# Altium schematic sheet [07] - CONNECTORS 2.SchDoc
size A3; DocumentNumber: 7; SheetNumber: 7; SheetTotal: 9
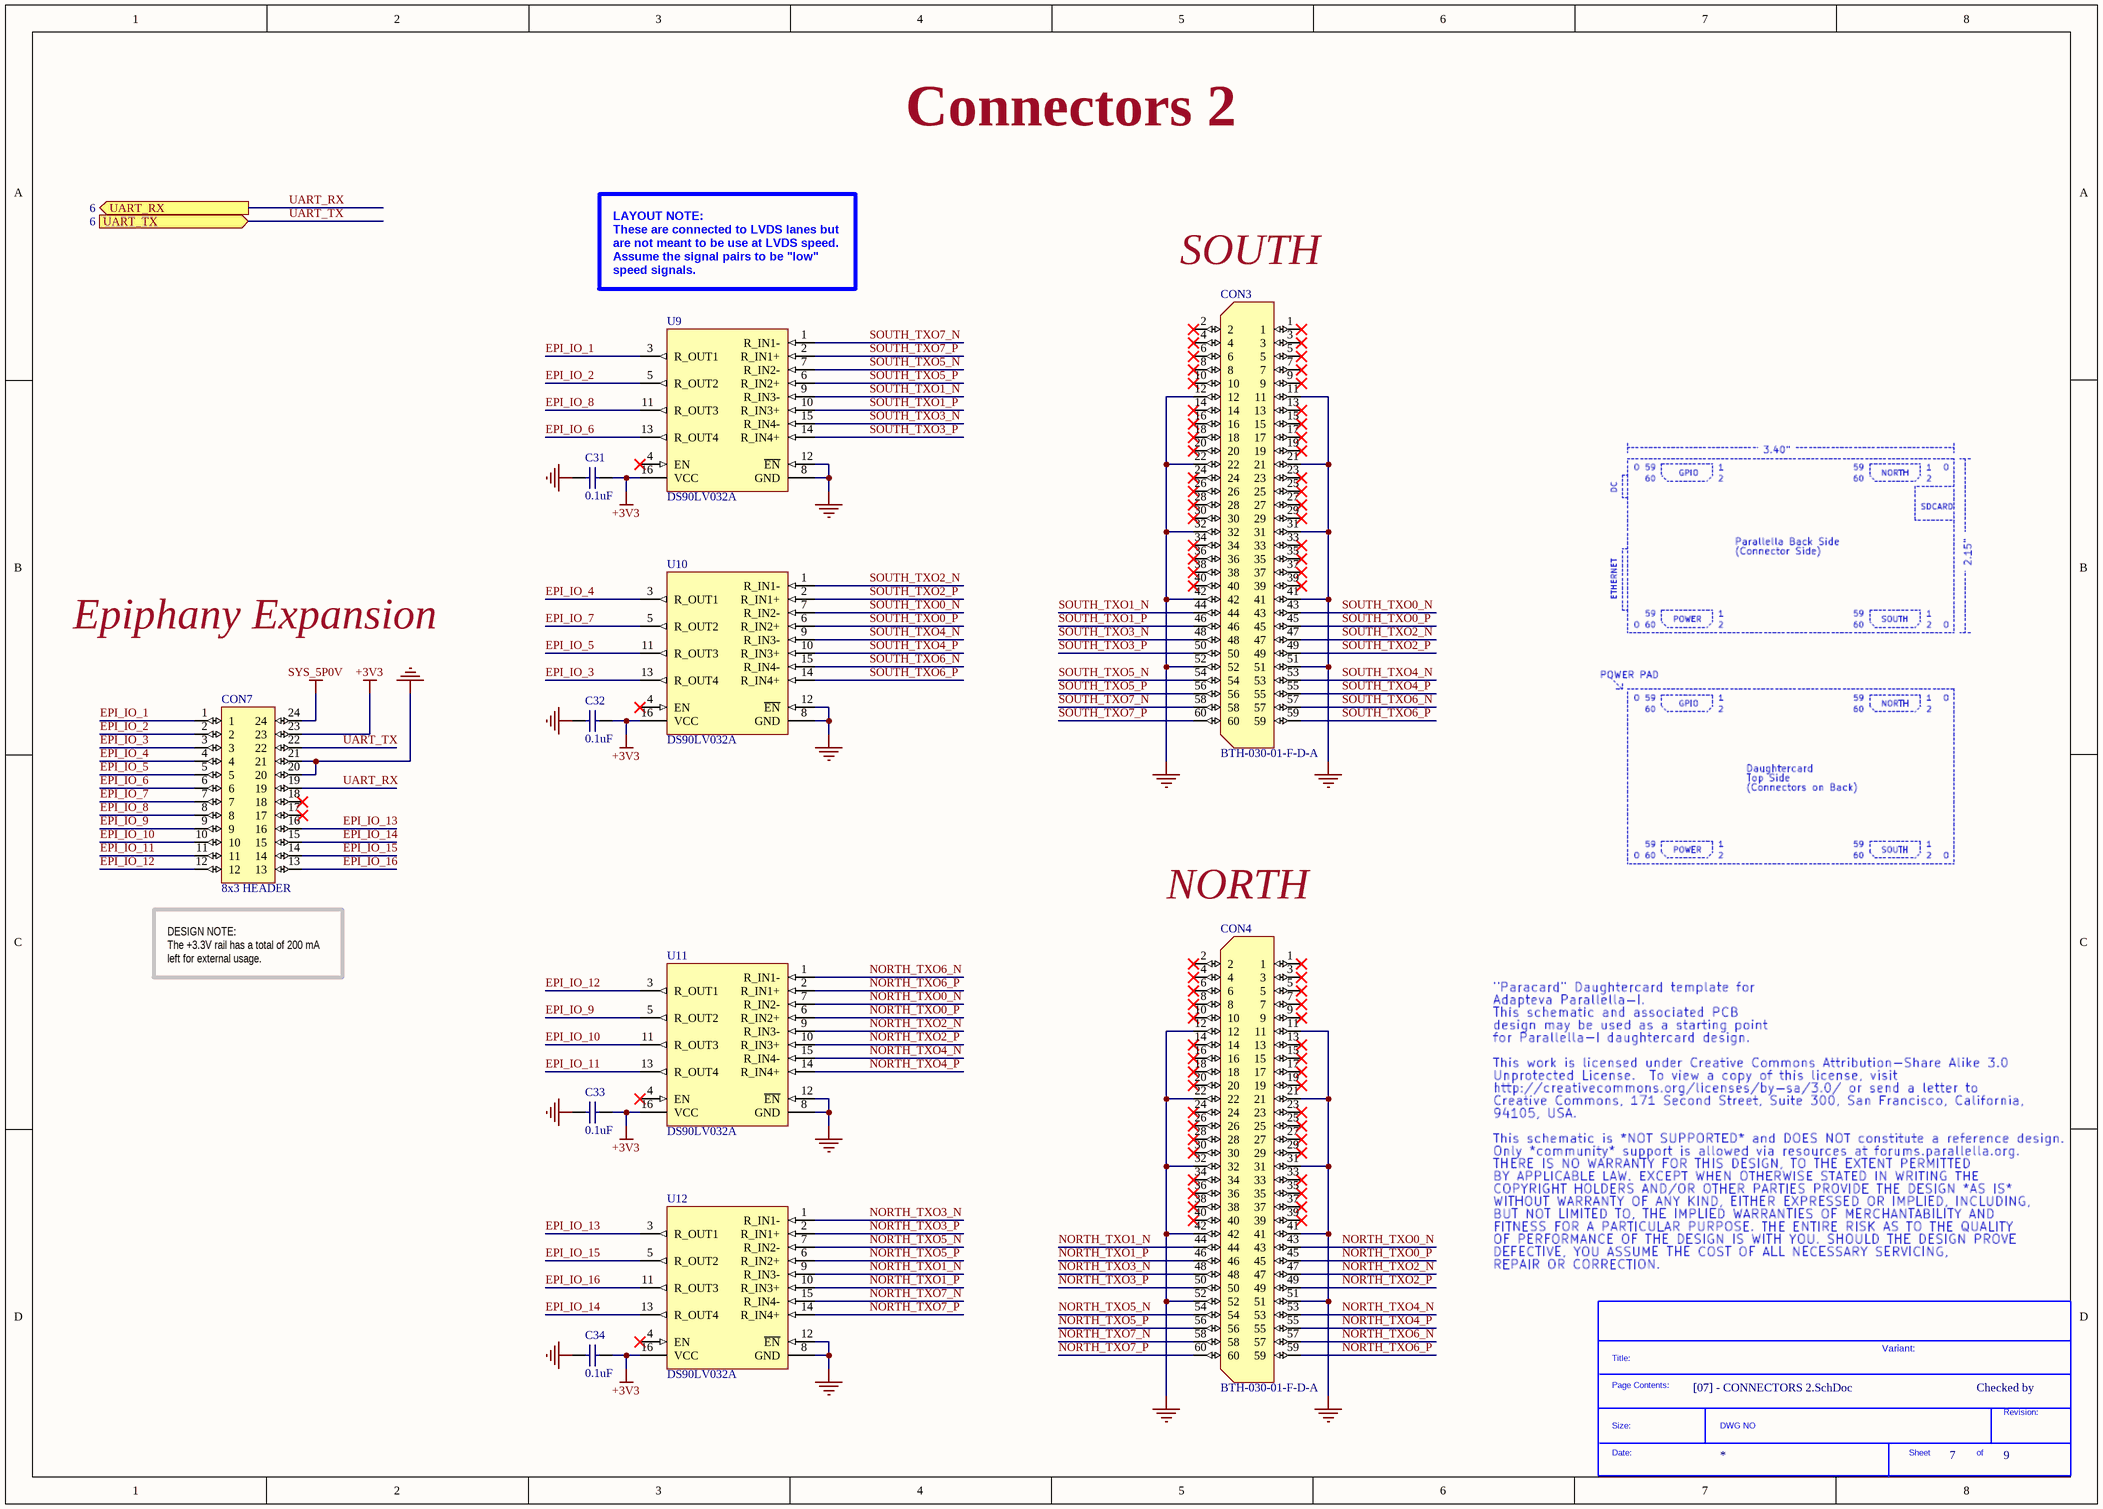
[diagram p0: [07] - CONNECTORS 2.SchDoc]

## Parts
*  SDTitleBlock  (value not drawn)  (graphical)
C31  0.1uF  [C0603L]
C32  0.1uF  [C0603L]
C33  0.1uF  [C0603L]
C34  0.1uF  [C0603L]
CON3  BTH-030-01-F-D-A  [BTH-030-01-X-D-A-K]
CON4  BTH-030-01-F-D-A  [BTH-030-01-X-D-A-K]
CON7  8x3 HEADER  [8x3HEADER_2.54mm]
U9  DS90LV032A  [TSSOP16N]
U10  DS90LV032A  [TSSOP16N]
U11  DS90LV032A  [TSSOP16N]
U12  DS90LV032A  [TSSOP16N]

## Ports
UART_RX (out, see 6), UART_TX (in, see 6)

## Nets
+3V3: C31.2 C32.2 C33.2 C34.2 CON7.23 U9.16(VCC) U10.16(VCC) U11.16(VCC) U12.16(VCC)
GND: C31.1 C32.1 C33.1 C34.1 CON3.11 CON3.12 CON3.21 CON3.22 CON3.31 CON3.32 CON3.41 CON3.42 CON3.51 CON3.52 CON4.11 CON4.12 CON4.21 CON4.22 CON4.31 CON4.32 CON4.41 CON4.42 CON4.51 CON4.52 CON7.20 CON7.21 U9.8(GND) U9.12(~{EN}) U10.8(GND) U10.12(~{EN}) U11.8(GND) U11.12(~{EN}) U12.8(GND) U12.12(~{EN})
SYS_5P0V: CON7.24
EPI_IO_1: CON7.1 U9.3(R_OUT1)
EPI_IO_2: CON7.2 U9.5(R_OUT2)
EPI_IO_3: CON7.3 U10.13(R_OUT4)
EPI_IO_4: CON7.4 U10.3(R_OUT1)
EPI_IO_5: CON7.5 U10.11(R_OUT3)
EPI_IO_6: CON7.6 U9.13(R_OUT4)
EPI_IO_7: CON7.7 U10.5(R_OUT2)
EPI_IO_8: CON7.8 U9.11(R_OUT3)
EPI_IO_9: CON7.9 U11.5(R_OUT2)
EPI_IO_10: CON7.10 U11.11(R_OUT3)
EPI_IO_11: CON7.11 U11.13(R_OUT4)
EPI_IO_12: CON7.12 U11.3(R_OUT1)
EPI_IO_13: CON7.16 U12.3(R_OUT1)
EPI_IO_14: CON7.15 U12.13(R_OUT4)
EPI_IO_15: CON7.14 U12.5(R_OUT2)
EPI_IO_16: CON7.13 U12.11(R_OUT3)
NORTH_TXO0_N: CON4.43 U11.7(R_IN2-)
NORTH_TXO0_P: CON4.45 U11.6(R_IN2+)
NORTH_TXO1_N: CON4.44 U12.9(R_IN3-)
NORTH_TXO1_P: CON4.46 U12.10(R_IN3+)
NORTH_TXO2_N: CON4.47 U11.9(R_IN3-)
NORTH_TXO2_P: CON4.49 U11.10(R_IN3+)
NORTH_TXO3_N: CON4.48 U12.1(R_IN1-)
NORTH_TXO3_P: CON4.50 U12.2(R_IN1+)
NORTH_TXO4_N: CON4.53 U11.15(R_IN4-)
NORTH_TXO4_P: CON4.55 U11.14(R_IN4+)
NORTH_TXO5_N: CON4.54 U12.7(R_IN2-)
NORTH_TXO5_P: CON4.56 U12.6(R_IN2+)
NORTH_TXO6_N: CON4.57 U11.1(R_IN1-)
NORTH_TXO6_P: CON4.59 U11.2(R_IN1+)
NORTH_TXO7_N: CON4.58 U12.15(R_IN4-)
NORTH_TXO7_P: CON4.60 U12.14(R_IN4+)
SOUTH_TXO0_N: CON3.43 U10.7(R_IN2-)
SOUTH_TXO0_P: CON3.45 U10.6(R_IN2+)
SOUTH_TXO1_N: CON3.44 U9.9(R_IN3-)
SOUTH_TXO1_P: CON3.46 U9.10(R_IN3+)
SOUTH_TXO2_N: CON3.47 U10.1(R_IN1-)
SOUTH_TXO2_P: CON3.49 U10.2(R_IN1+)
SOUTH_TXO3_N: CON3.48 U9.15(R_IN4-)
SOUTH_TXO3_P: CON3.50 U9.14(R_IN4+)
SOUTH_TXO4_N: CON3.53 U10.9(R_IN3-)
SOUTH_TXO4_P: CON3.55 U10.10(R_IN3+)
SOUTH_TXO5_N: CON3.54 U9.7(R_IN2-)
SOUTH_TXO5_P: CON3.56 U9.6(R_IN2+)
SOUTH_TXO6_N: CON3.57 U10.15(R_IN4-)
SOUTH_TXO6_P: CON3.59 U10.14(R_IN4+)
SOUTH_TXO7_N: CON3.58 U9.1(R_IN1-)
SOUTH_TXO7_P: CON3.60 U9.2(R_IN1+)
UART_RX: CON7.19 ; port UART_RX
UART_TX: CON7.22 ; port UART_TX

Not connected (* = marked no-connect by the designer): CON3 1* 2* 3* 4* 5* 6* 7* 8* 9* 10* 13* 14* 15* 16* 17* 18* 19* 20* 23* 24* 25* 26* 27* 28* 29* 30* 33* 34* 35* 36* 37* 38* 39* 40*; CON4 1* 2* 3* 4* 5* 6* 7* 8* 9* 10* 13* 14* 15* 16* 17* 18* 19* 20* 23* 24* 25* 26* 27* 28* 29* 30* 33* 34* 35* 36* 37* 38* 39* 40*; CON7 17* 18*; U9 4(EN)*; U10 4(EN)*; U11 4(EN)*; U12 4(EN)*

## Notes on the sheet
- Connectors 2
- LAYOUT NOTE:
  These are connected to LVDS lanes but
  are not meant to be use at LVDS speed.
  Assume the signal pairs to be "low"
  speed signals.
- SOUTH
- Epiphany Expansion
- NORTH
- DESIGN NOTE:
  The +3.3V rail has a total of 200 mA left for external usage.
- Variant:
- Checked by
- (in symbol SDTitleBlock) Title:; Page Contents:; Revision:; Size:; DWG NO; Date:; Sheet; of

## Library data of the parts
C31-C34 = GRM188R71H104KA93J: CAP CER 0.1UF 50V 10% X7R 0603; Manufacturer: Murata Electronics North America; Capacitance: 0.1µF; Supplier 1: Digi-Key; Manufacturer Part Number: GRM188R71H104KA93J; RoHS: RoHS Compliant; Category: Capacitors; Stock 1: 4487; Pricing 1: 1=0.12, 10=0.088, 50=0.048, 100=0.0405, 250=0.03316, 500=0.02838, 1000=0.02211, 5000=0.01843 (EUR); Packaging: Cut Tape (CT); Tolerance: ±10%; Voltage - Rated: 50V; Temperature Coefficient: X7R; Mounting Type: Surface Mount, MLCC; Operating Temperature: -55°C ~ 125°C; Applications: General Purpose; Ratings: -; Package / Case: 0603 (1608 Metric); Size / Dimension: 0.063" L x 0.031" W (1.60mm x 0.80mm); Height - Seated (Max): -; Thickness (Max): 0.035" (0.90mm); Lead Spacing: -; Features: -; Lead Style: -; ComponentLink1URL: http://www.murata.com/~/media/webrenewal/support/library/catalog/products/capacitor/mlcc/c02e.ashx; ComponentLink1Description: http://www.murata.com/~/media/webrenewal/support/library/catalog/products/capacitor/mlcc/c02e.ashx; Supplier Part Number 1: 490-9735-1-ND
CON3 CON4 = BTH-030-01-F-D-A: CONN RCPT 60POS 0.5MM SMD; Manufacturer: Samtec Inc; Connector Type: Socket, Center Strip Contacts; Number of Positions: 60; Pitch: 0.020" (0.50mm); Mated Stacking Heights: 5mm; Supplier 1: Digi-Key; Manufacturer Part Number: BTH-030-01-F-D-A; RoHS: RoHS Compliant; Category: Connectors, Interconnects; Stock 1: 0; Pricing 1: 1=5.93 (EUR); Packaging: Tray; Number of Rows: 2; Mounting Type: Surface Mount; Features: Board Guide; Contact Finish: Gold; Contact Finish Thickness: Flash; Height Above Board: 0.128" (3.25mm); ComponentLink1URL: http://www.samtec.com/ftppub/cpdf/BSH-XXX-01-X-D-XX-XX-MKT.pdf; ComponentLink1Description: http://www.samtec.com/ftppub/cpdf/BSH-XXX-01-X-D-XX-XX-MKT.pdf; Supplier Part Number 1: BTH-030-01-F-D-A-ND
U9-U12 = DS90LV032ATMTCX/NOPB: IC LINE RVR 3V QUAD DIFF 16TSSOP; Manufacturer: Texas Instruments; Protocol: LVDS; Number of Drivers/Receivers: 0/4; Data Rate: 400Mbps; Voltage - Supply: 3 V ~ 3.6 V; Supplier 1: Digi-Key; Manufacturer Part Number: DS90LV032ATMTCX/NOPB; RoHS: RoHS Compliant; Category: Integrated Circuits (ICs); Stock 1: 2212; Pricing 1: 1=2.63, 10=2.371, 25=2.124, 100=1.9099, 250=1.69584, 500=1.48182, 750=1.34187, 1000=1.22661 (EUR); Packaging: Cut Tape (CT); Type: Receiver; Duplex: -; Receiver Hysteresis: -; Operating Temperature: -40°C ~ 85°C; Mounting Type: Surface Mount; Package / Case: 16-TSSOP (0.173", 4.40mm Width); Supplier Device Package: 16-TSSOP; ComponentLink1URL: http://www.ti.com/lit/ds/symlink/ds90lv032a.pdf; ComponentLink1Description: http://www.ti.com/lit/ds/symlink/ds90lv032a.pdf; Supplier Part Number 1: 296-41254-1-ND